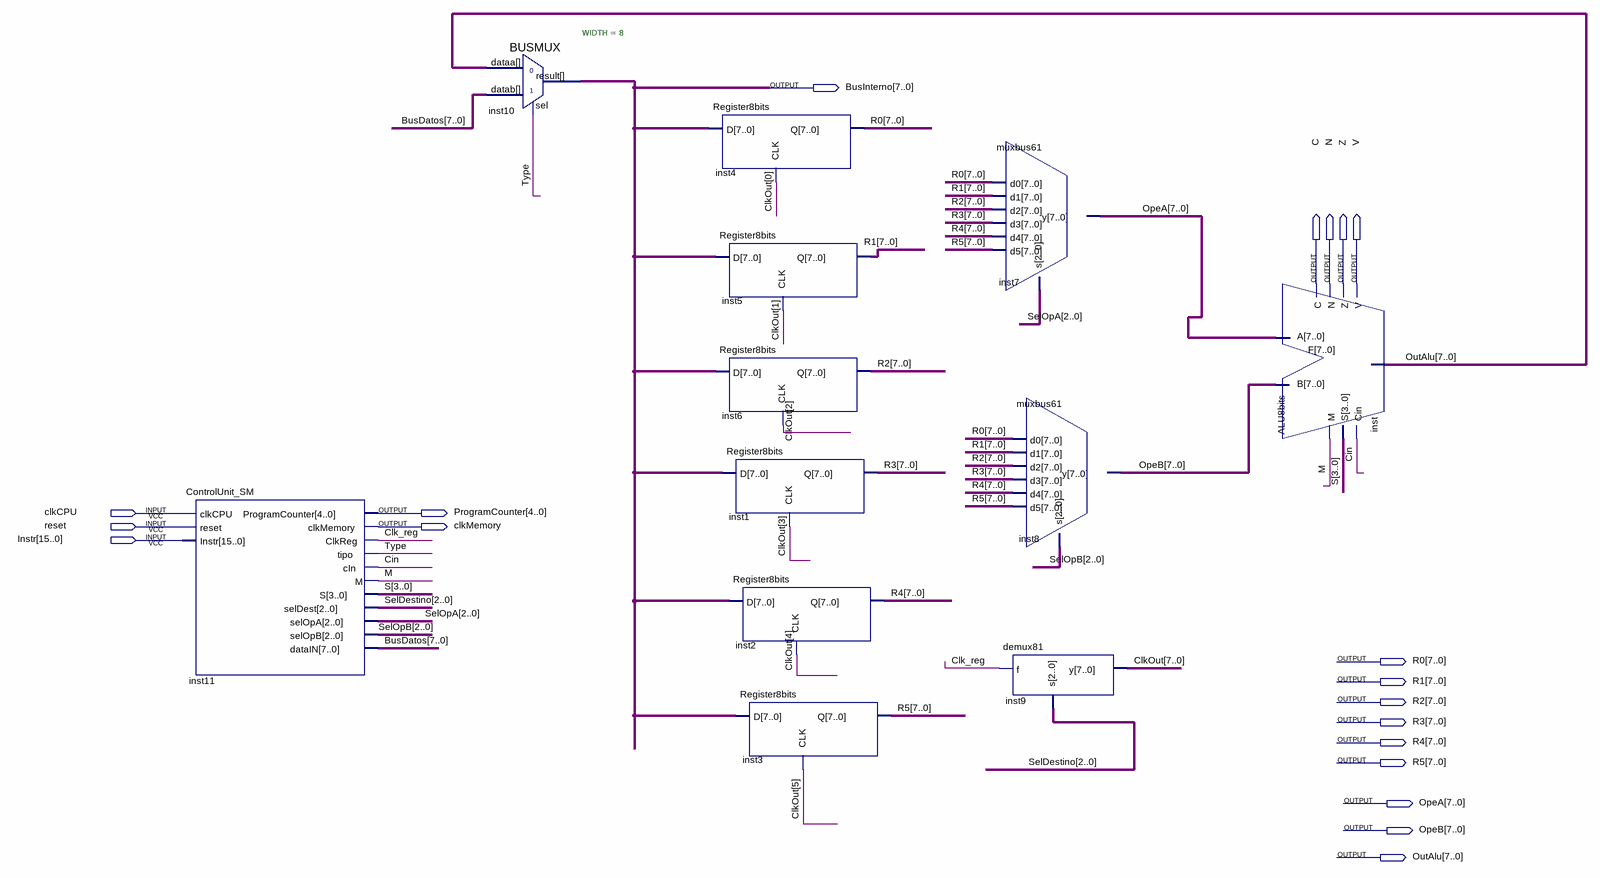
[diagram p0: schematic sheet]
// Quartus schematic CPU8bits_v1.bdf as structural Verilog: 12 symbols, 19 pins
module CPU8bits_v1 (
  input  clkCPU,
  input  reset,
  input  [15:0] Instr,
  output [7:0] BusInterno,
  output C,
  output N,
  output Z,
  output V,
  output [4:0] ProgramCounter,
  output clkMemory,
  output [7:0] R0,
  output [7:0] R1,
  output [7:0] R2,
  output [7:0] R3,
  output [7:0] R4,
  output [7:0] R5,
  output [7:0] OpeA,
  output [7:0] OpeB,
  output [7:0] OutAlu
);

  wire Cin, Clk_reg, M, Type;
  wire [2:0] SelDestino, SelOpA, SelOpB;
  wire [3:0] S;
  wire [7:0] BusDatos, ClkOut;

  ControlUnit_SM inst11 (
    .clkCPU(clkCPU), .reset(reset), .Instr(Instr), .ProgramCounter(ProgramCounter), .clkMemory(clkMemory),
    .ClkReg(Clk_reg), .tipo(Type), .cIn(Cin), .M(M), .S(S), .selDest(SelDestino), .selOpA(SelOpA),
    .selOpB(SelOpB), .dataIN(BusDatos));
  BUSMUX #(.WIDTH(8)) inst10 (.datab(BusDatos), .sel(Type), .dataa(OutAlu), .result(BusInterno));
  Register8bits inst4 (.D(BusInterno), .CLK(ClkOut[0]), .Q(R0));
  Register8bits inst5 (.D(BusInterno), .CLK(ClkOut[1]), .Q(R1));
  Register8bits inst6 (.D(BusInterno), .CLK(ClkOut[2]), .Q(R2));
  Register8bits inst1 (.D(BusInterno), .CLK(ClkOut[3]), .Q(R3));
  Register8bits inst2 (.D(BusInterno), .CLK(ClkOut[4]), .Q(R4));
  Register8bits inst3 (.D(BusInterno), .CLK(ClkOut[5]), .Q(R5));
  muxbus61 inst7 (.s(SelOpA), .d0(R0), .d1(R1), .d2(R2), .d3(R3), .d4(R4), .d5(R5), .y(OpeA));
  muxbus61 inst8 (.s(SelOpB), .d0(R0), .d1(R1), .d2(R2), .d3(R3), .d4(R4), .d5(R5), .y(OpeB));
  demux81 inst9 (.f(Clk_reg), .s(SelDestino), .y(ClkOut));
  ALU8bits inst (.A(OpeA), .B(OpeB), .M(M), .S(S), .Cin(Cin), .F(OutAlu), .C(C), .N(N), .Z(Z), .V(V));
endmodule
